# Altium schematic sheet top_power.SchDoc: Electrical Power System - General Block Diagram - Power
size A3; Date: 2015-08-29; Author: Piotr Kuligowski; Revision: 1-0; SheetNumber: 1; SheetTotal: 8; Model: EM1; PageSetup: Record=PageOptions|CenterHorizontal=True|CenterVertical=True|PrintScale=0.52|XCorrection=1.00|YCorrection=1.00|PrintKind=1|BorderSize=5000000|LeftOffset=0|BottomOffset=0|Orientation=2|PaperLength=4200|PaperWidth=2970|Scale=100|PaperSource=7|PrintQuality=600|MediaType=1|DitherType=10|PaperKind=A3|PrintScaleMode=1
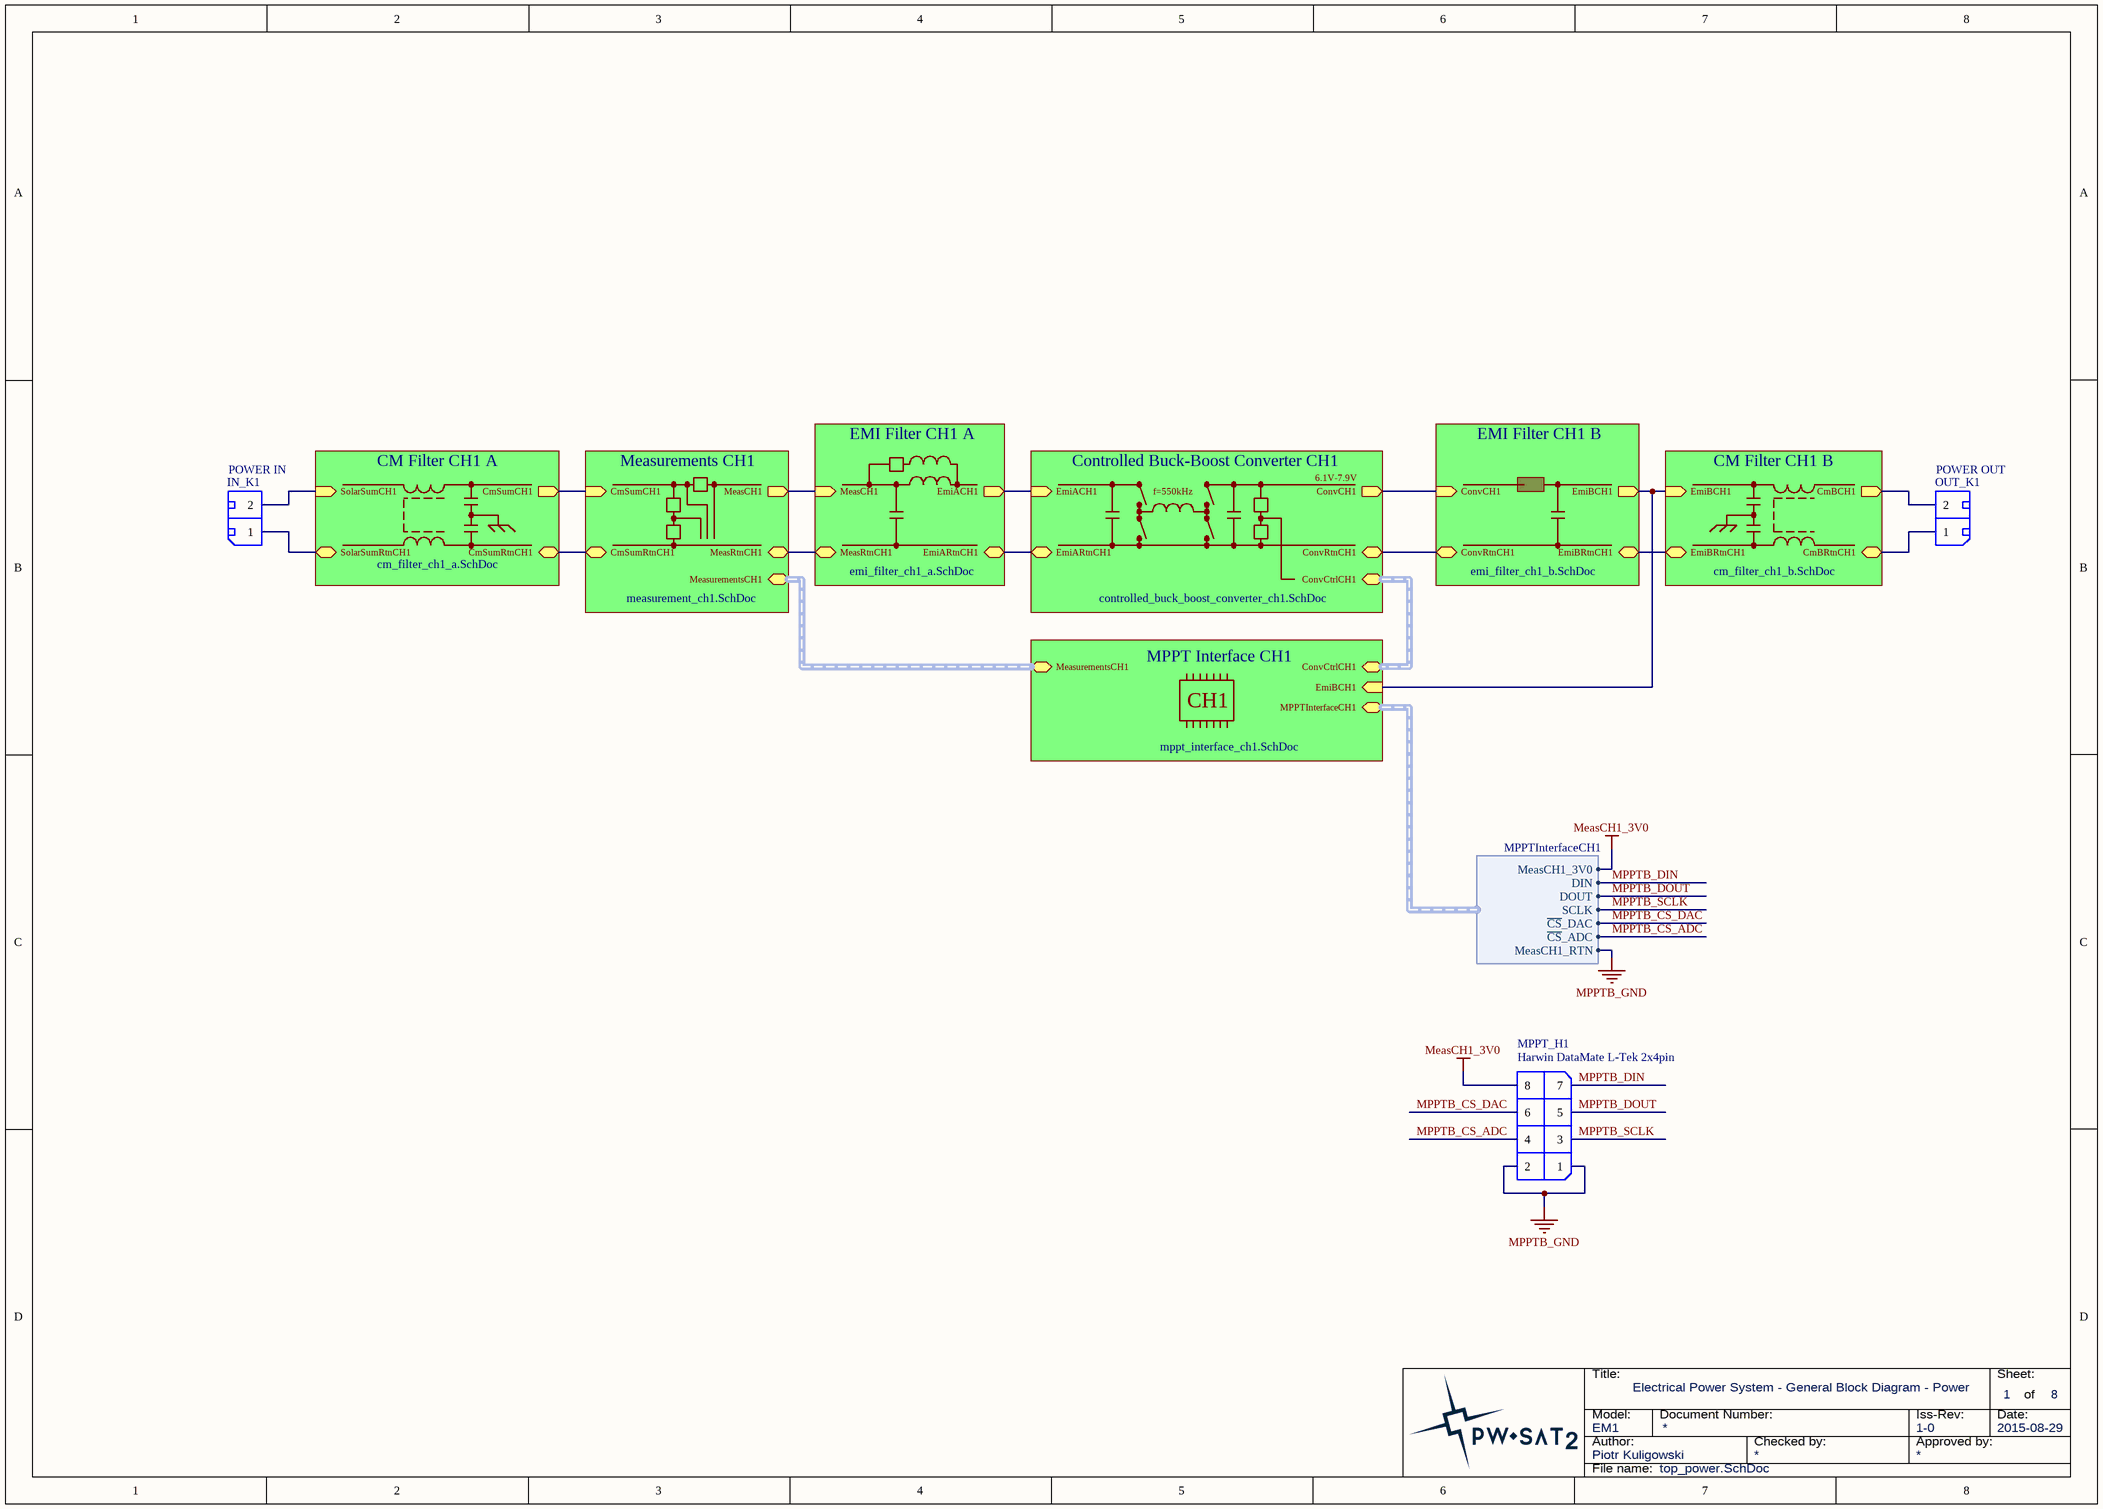
[diagram p0: top_power.SchDoc]

## Parts
IN_K1  ProviderPartNumber: POWER IN  [TerminalBlock_Spring_2.54_2-R]  (hidden comment: TB-2.5-PD-xx)
MPPT_H1  Harwin DataMate L-Tek 2x4pin  [Harwin_Datamate_L-Tek_M80-8670805]
OUT_K1  ProviderPartNumber: POWER OUT  [TerminalBlock_Spring_2.54_2-R]  (hidden comment: TB-2.5-PD-xx)

## Sub-sheets
CM Filter CH1 A = cm_filter_ch1_a.SchDoc: CmSumCH1 (out), SolarSumCH1 (in), SolarSumRtnCH1, CmSumRtnCH1
CM Filter CH1 B = cm_filter_ch1_b.SchDoc: CmBCH1 (out), EmiBCH1 (in), EmiBRtnCH1, CmBRtnCH1
Controlled Buck-Boost Converter CH1 = controlled_buck_boost_converter_ch1.SchDoc: ConvCH1 (out), ConvRtnCH1, EmiACH1 (in), EmiARtnCH1, ConvCtrlCH1 (harness ConvCtrlCH1)
EMI Filter CH1 A = emi_filter_ch1_a.SchDoc: EmiACH1 (out), MeasCH1 (in), MeasRtnCH1, EmiARtnCH1
EMI Filter CH1 B = emi_filter_ch1_b.SchDoc: EmiBCH1 (out), ConvCH1 (in), ConvRtnCH1, EmiBRtnCH1
Measurements CH1 = measurement_ch1.SchDoc: MeasCH1 (out), CmSumCH1 (in), MeasRtnCH1, CmSumRtnCH1, MeasurementsCH1 (harness MeasurementsCH1)
MPPT Interface CH1 = mppt_interface_ch1.SchDoc: MPPTInterfaceCH1 (harness MPPTInterfaceCH1), EmiBCH1 (in), MeasurementsCH1 (harness MeasurementsCH1), ConvCtrlCH1 (harness ConvCtrlCH1)

## Harnesses
MPPTInterfaceCH1: DIN, DOUT, SCLK, ~{CS}_DAC, ~{CS}_ADC, MeasCH1_3V0, MeasCH1_RTN

## Nets
MeasCH1_3V0: MPPT_H1.8 ; sheet MPPT Interface CH1/MPPTInterfaceCH1.MeasCH1_3V0
MPPTB_GND: MPPT_H1.1 MPPT_H1.2 ; sheet MPPT Interface CH1/MPPTInterfaceCH1.MeasCH1_RTN
MPPTB_CS_ADC: MPPT_H1.4 ; sheet MPPT Interface CH1/MPPTInterfaceCH1.~{CS}_ADC
MPPTB_CS_DAC: MPPT_H1.6 ; sheet MPPT Interface CH1/MPPTInterfaceCH1.~{CS}_DAC
MPPTB_DIN: MPPT_H1.7 ; sheet MPPT Interface CH1/MPPTInterfaceCH1.DIN
MPPTB_DOUT: MPPT_H1.5 ; sheet MPPT Interface CH1/MPPTInterfaceCH1.DOUT
MPPTB_SCLK: MPPT_H1.3 ; sheet MPPT Interface CH1/MPPTInterfaceCH1.SCLK
NetIN_K1_1: IN_K1.1 ; sheet CM Filter CH1 A/SolarSumRtnCH1
NetIN_K1_2: IN_K1.2 ; sheet CM Filter CH1 A/SolarSumCH1
NetOUT_K1_1: OUT_K1.1 ; sheet CM Filter CH1 B/CmBRtnCH1
NetOUT_K1_2: OUT_K1.2 ; sheet CM Filter CH1 B/CmBCH1
(unnamed): sheet CM Filter CH1 A/CmSumCH1, sheet Measurements CH1/CmSumCH1
(unnamed): sheet CM Filter CH1 A/CmSumRtnCH1, sheet Measurements CH1/CmSumRtnCH1
(unnamed): sheet MPPT Interface CH1/EmiBCH1, sheet EMI Filter CH1 B/EmiBCH1, sheet CM Filter CH1 B/EmiBCH1
(unnamed): sheet Measurements CH1/MeasCH1, sheet EMI Filter CH1 A/MeasCH1
(unnamed): sheet Measurements CH1/MeasRtnCH1, sheet EMI Filter CH1 A/MeasRtnCH1
(unnamed): sheet EMI Filter CH1 A/EmiACH1, sheet Controlled Buck-Boost Converter CH1/EmiACH1
(unnamed): sheet EMI Filter CH1 A/EmiARtnCH1, sheet Controlled Buck-Boost Converter CH1/EmiARtnCH1
(unnamed): sheet EMI Filter CH1 B/ConvCH1, sheet Controlled Buck-Boost Converter CH1/ConvCH1
(unnamed): sheet EMI Filter CH1 B/ConvRtnCH1, sheet Controlled Buck-Boost Converter CH1/ConvRtnCH1
(unnamed): sheet EMI Filter CH1 B/EmiBRtnCH1, sheet CM Filter CH1 B/EmiBRtnCH1

## Buses and harness runs
harness sheet Controlled Buck-Boost Converter CH1/ConvCtrlCH1 = sheet MPPT Interface CH1/ConvCtrlCH1
harness sheet Measurements CH1/MeasurementsCH1 = sheet MPPT Interface CH1/MeasurementsCH1

## Notes on the sheet
- f=550kHz
- 6.1V-7.9V
- CH1
- Title:
- Sheet:
- of
- Author:
- Model:
- Document Number:
- Checked by:
- Iss-Rev:
- Approved by:
- Date:
- File name:

## Library data of the parts
IN_K1 OUT_K1 = TerminalBlock_Spring_2.54_2-R: Terminal block with spring, 2-pin, 2.54mm pitch, right angle.; Provider: TME.eu; Value: TB-2.5-PD-xx
MPPT_H1 = Harwin_Datamate_L-Tek_2x4pin: Harwin DataMate L-Tek, 2mm pitch, 2x4pin.; Value: Harwin DataMate L-Tek 2x4pin